# Altium schematic sheet Top.SchDoc: USBC Hub
size 431 x 279 mm; Author: Eric Liu; SheetNumber: 1; SheetTotal: 6
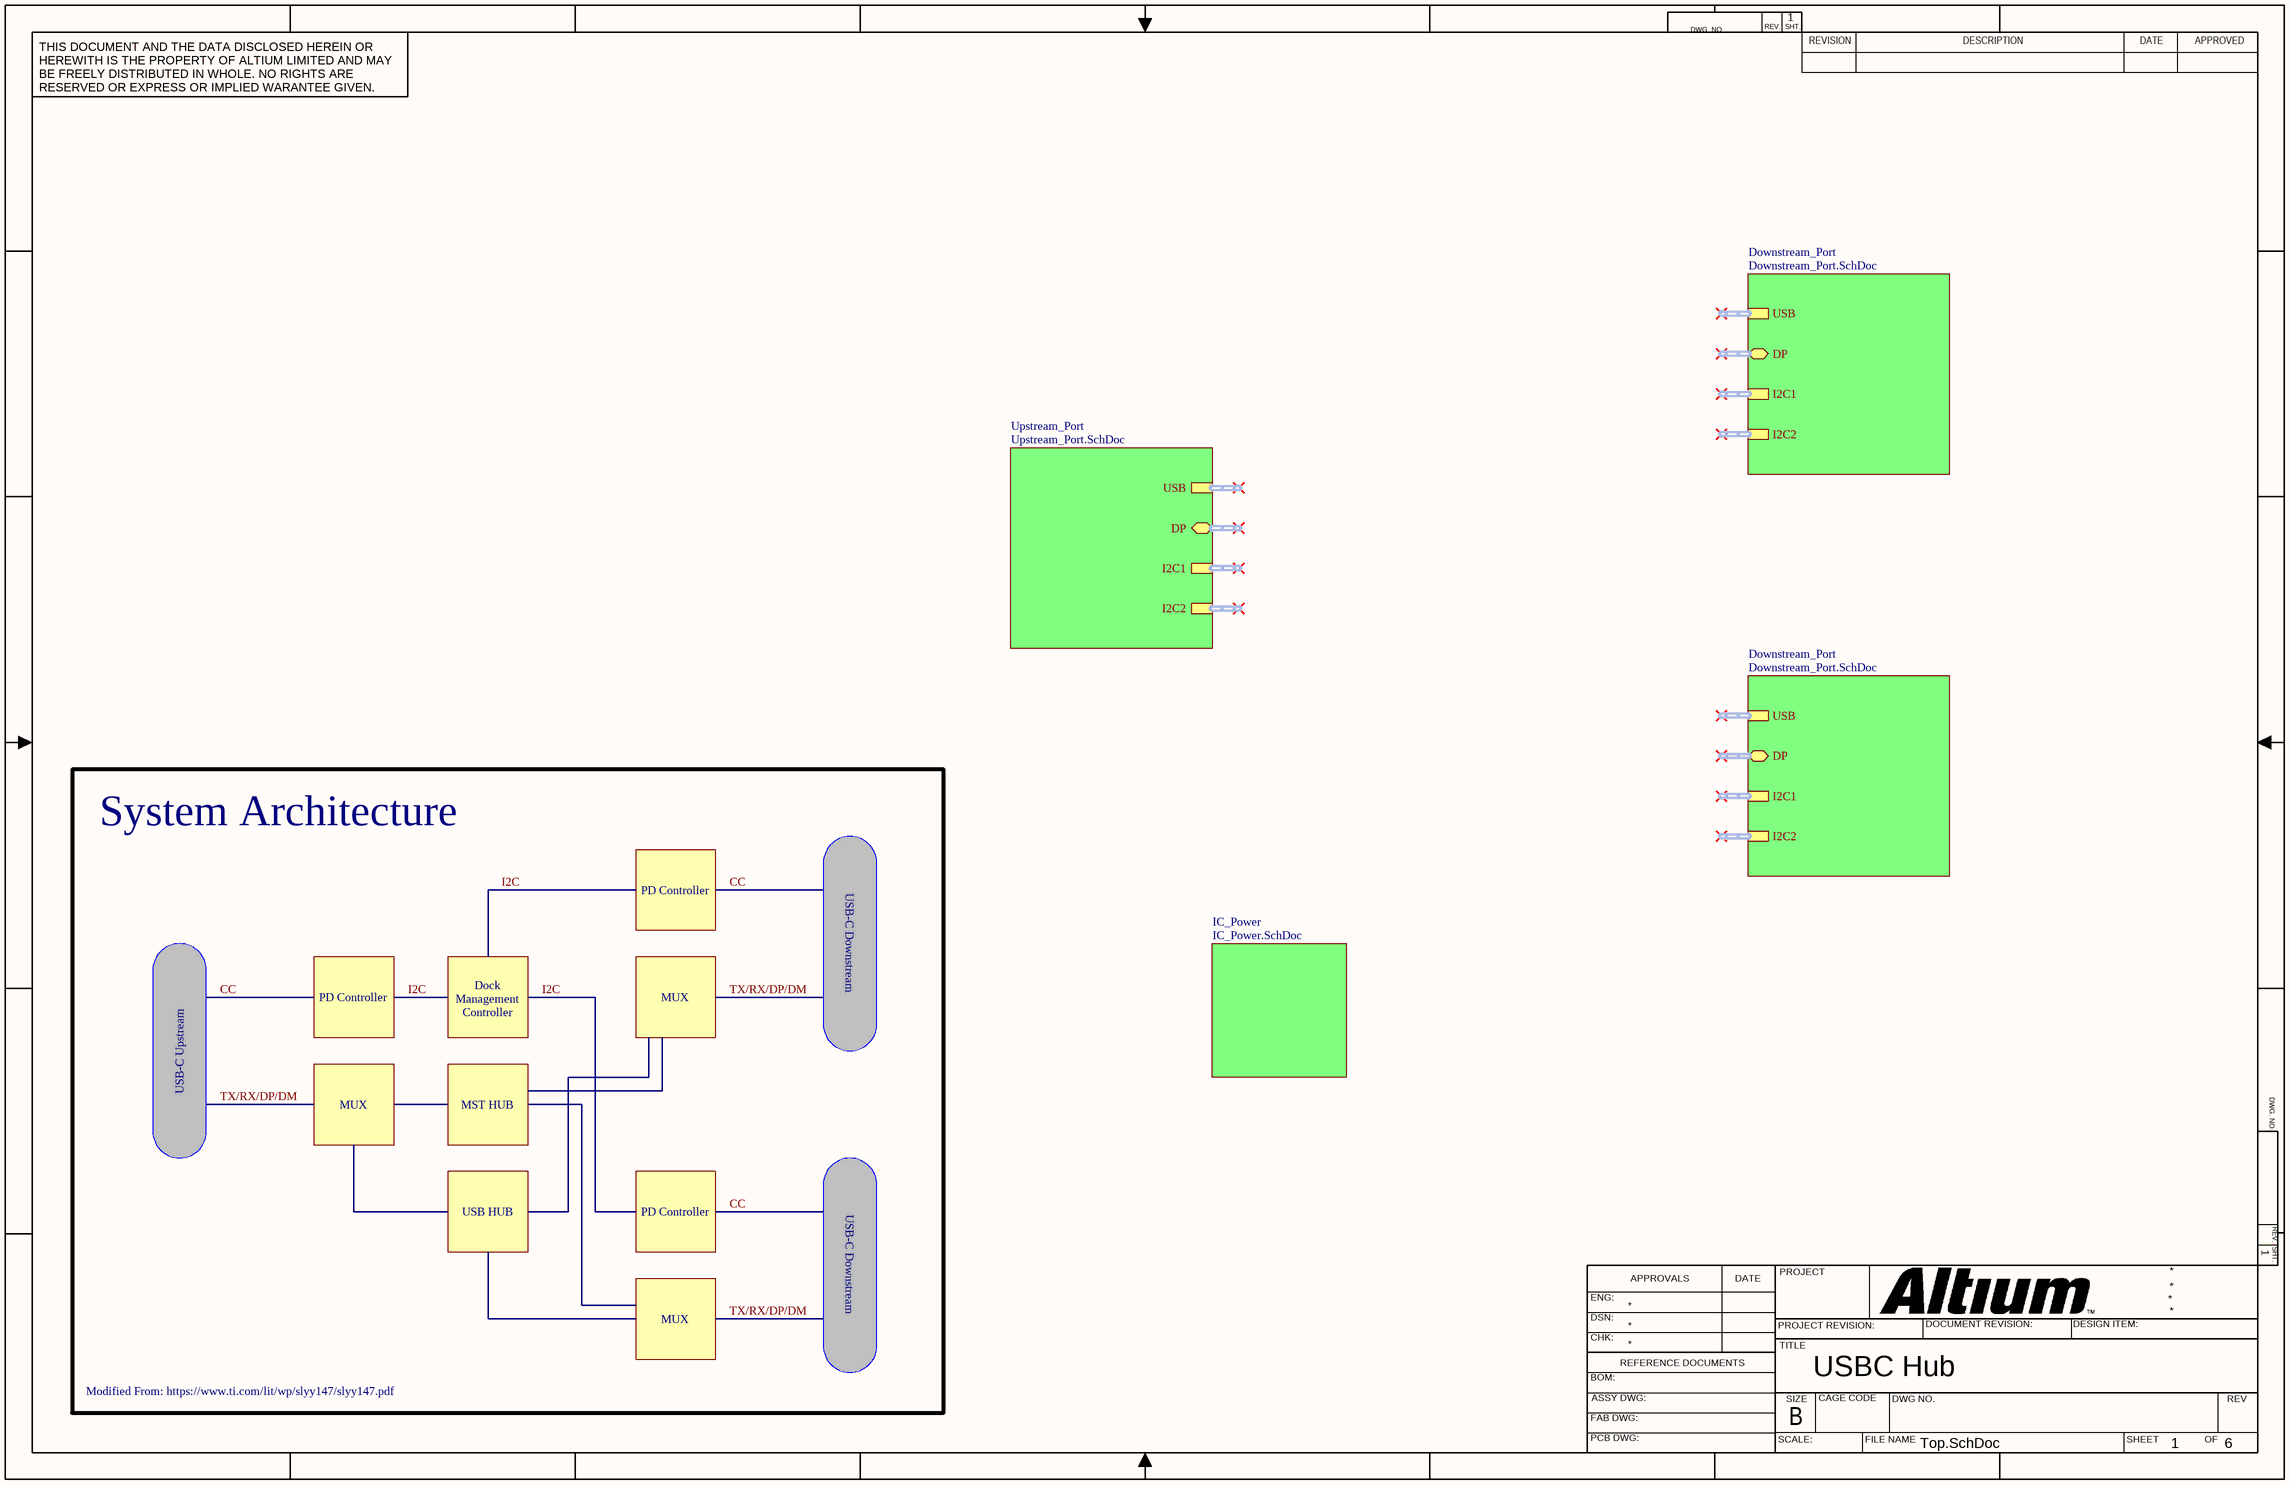
[diagram p0: Top.SchDoc]

## Sub-sheets
Downstream_Port = Downstream_Port.SchDoc: USB (harness USB), I2C1 (harness USB), DP (bidir, harness DP), I2C2 (harness USB)
Downstream_Port = Downstream_Port.SchDoc: USB (harness USB), I2C1 (harness USB), DP (bidir, harness DP), I2C2 (harness USB)
IC_Power = IC_Power.SchDoc: no entries
Upstream_Port = Upstream_Port.SchDoc: USB (harness USB), I2C1 (harness USB), DP (bidir, harness DP), I2C2 (harness USB)

## Notes on the sheet
- System Architecture
- PD Controller
- USB-C Downstream
- Dock
  Management
  Controller
- MUX
- USB-C Upstream
- MST HUB
- USB HUB
- Modified From: https://www.ti.com/lit/wp/slyy147/slyy147.pdf
- DWG. NO.
- REV.
- SHT.
- THIS DOCUMENT AND THE DATA DISCLOSED HEREIN OR HEREWITH IS THE PROPERTY OF ALTIUM LIMITED AND MAY BE FREELY DISTRIBUTED IN WHOLE. NO RIGHTS ARE RESERVED OR EXPRESS OR IMPLIED WARANTEE GIVEN.
- REVISION
- DESCRIPTION
- DATE
- APPROVED
- ENG:
- APPROVALS
- PROJECT
- DSN:
- CHK:
- REFERENCE DOCUMENTS
- PROJECT REVISION:
- TITLE
- DOCUMENT REVISION:
- DESIGN ITEM:
- BOM:
- FAB DWG:
- PCB DWG:
- ASSY DWG:
- SCALE:
- SIZE
- B
- CAGE CODE
- FILE NAME
- DWG NO.
- SHEET
- OF
- REV